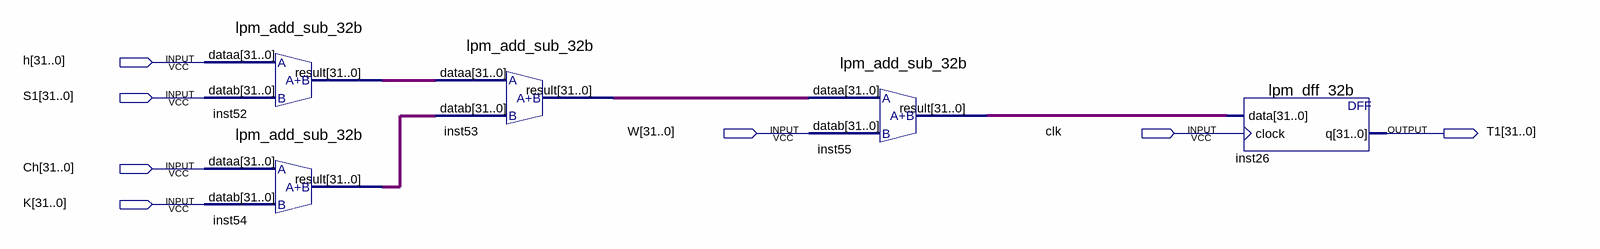
[diagram p0: schematic sheet]
// Quartus schematic T1.bdf as structural Verilog: 5 symbols, 7 pins
module T1 (
  input  [31:0] h,
  input  [31:0] S1,
  input  [31:0] W,
  input  clk,
  input  [31:0] Ch,
  input  [31:0] K,
  output [31:0] T1
);

  wire [31:0] inst52_result, inst53_result, inst54_result, inst55_result;

  lpm_add_sub_32b inst52 (.dataa(h), .datab(S1), .result(inst52_result));
  lpm_add_sub_32b inst54 (.dataa(Ch), .datab(K), .result(inst54_result));
  lpm_add_sub_32b inst53 (.dataa(inst52_result), .datab(inst54_result), .result(inst53_result));
  lpm_add_sub_32b inst55 (.dataa(inst53_result), .datab(W), .result(inst55_result));
  lpm_dff_32b inst26 (.data(inst55_result), .clock(clk), .q(T1));
endmodule
